# EAGLE design HallSensor (EAGLE 8.7.1)
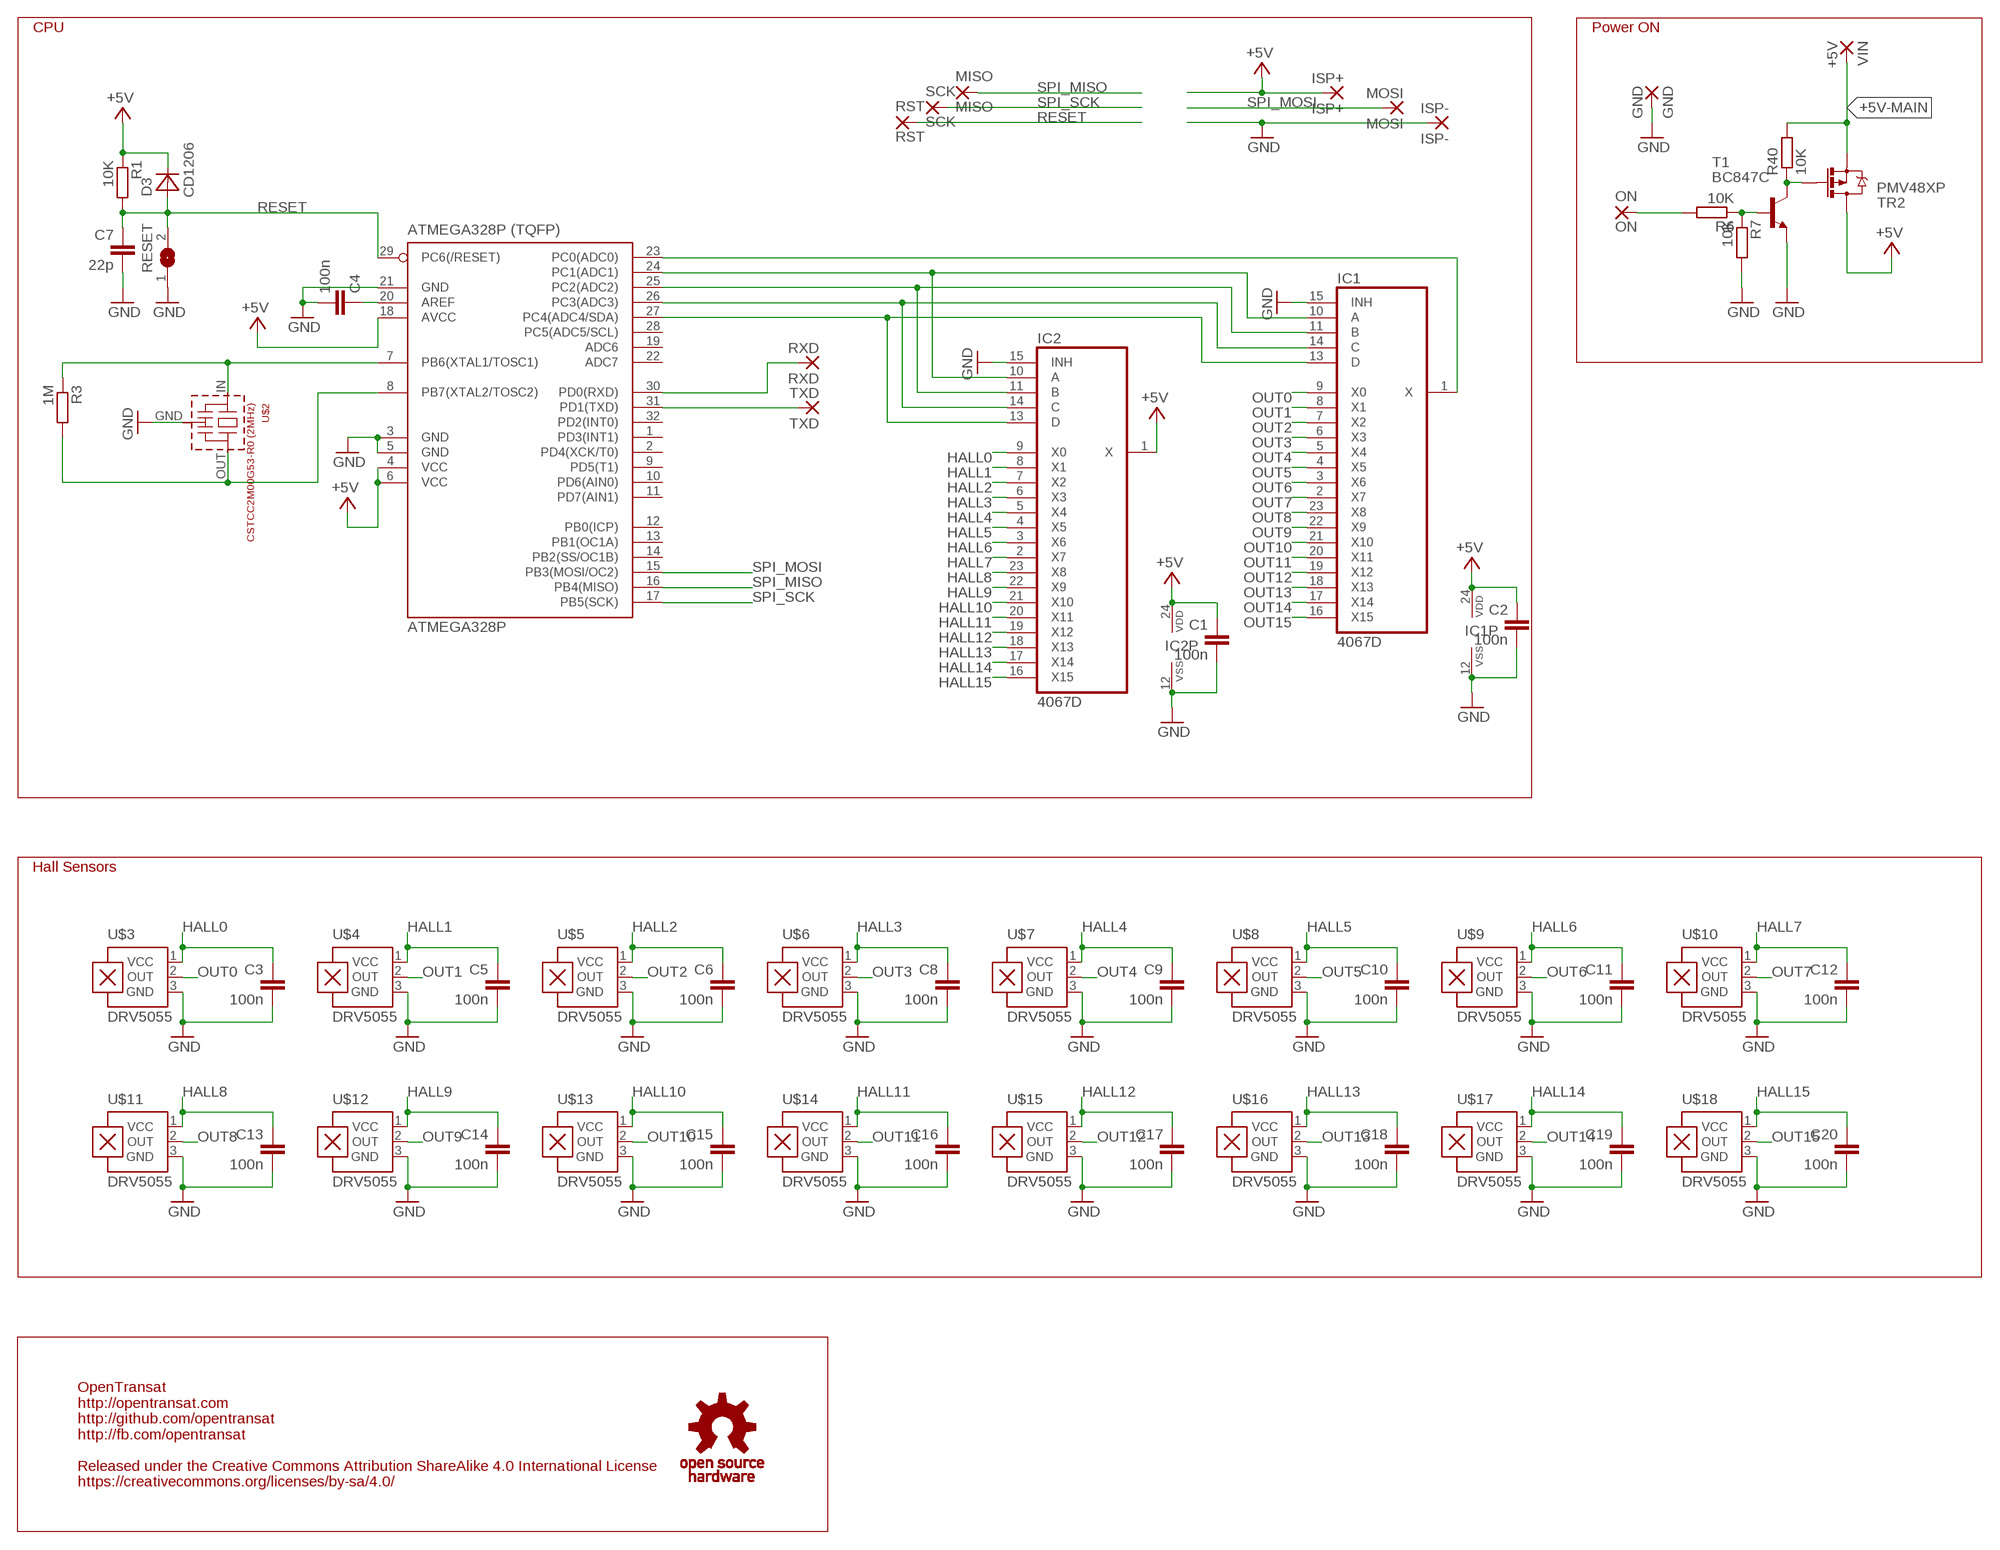
[diagram p0: schematic, sheet 1]

## Parts
ATMEGA328P  ATMEGA328P (TQFP)  MEGA8-AI  [TQFP32-08]
C1  100n  C-EUC0603  [C0603]
C2  100n  C-EUC0603  [C0603]
C3  100n  C-EUC0603  [C0603]
C4  100n  C-EUC0603  [C0603]
C5  100n  C-EUC0603  [C0603]
C6  100n  C-EUC0603  [C0603]
C7  22p  C-EUC0603  [C0603]
C8  100n  C-EUC0603  [C0603]
C9  100n  C-EUC0603  [C0603]
C10  100n  C-EUC0603  [C0603]
C11  100n  C-EUC0603  [C0603]
C12  100n  C-EUC0603  [C0603]
C13  100n  C-EUC0603  [C0603]
C14  100n  C-EUC0603  [C0603]
C15  100n  C-EUC0603  [C0603]
C16  100n  C-EUC0603  [C0603]
C17  100n  C-EUC0603  [C0603]
C18  100n  C-EUC0603  [C0603]
C19  100n  C-EUC0603  [C0603]
C20  100n  C-EUC0603  [C0603]
D3  CD1206  [R1206]
GND  GND  SMD5  [SMD2,54-5,08]
IC1  4067D  [SO24W]
IC2  4067D  [SO24W]
ISP+  ISP+  SMD5  [SMD2,54-5,08]
ISP-  ISP-  SMD5  [SMD2,54-5,08]
MISO  MISO  SMD5  [SMD2,54-5,08]
MOSI  MOSI  SMD5  [SMD2,54-5,08]
ON  ON  SMD5  [SMD2,54-5,08]
R1  10K  R-EU_R0603  [R0603]
R3  1M  R-EU_R0603  [R0603]
R6  10K  R-EU_R0603  [R0603]
R7  10K  R-EU_R0603  [R0603]
R40  10K  R-EU_R0603  [R0603]
RESET  SJW  [SJW]
RST  RST  SMD5  [SMD2,54-5,08]
RXD  RXD  SMD5  [SMD2,54-5,08]
SCK  SCK  SMD5  [SMD2,54-5,08]
T1  BC847C  BC847  [SOT23]
TR2  PMV48XP  MOSFET-PCHANNEL_SOT23-3  [SOT23-3]
TXD  TXD  SMD5  [SMD2,54-5,08]
U$1  OSHW_S  [OSHWS]
U$2  CSTCC2M00G53-R0 (2MHz)  CSTCC  [CSTCC]
U$3  DRV5055  [SOT23]
U$4  DRV5055  [SOT23]
U$5  DRV5055  [SOT23]
U$6  DRV5055  [SOT23]
U$7  DRV5055  [SOT23]
U$8  DRV5055  [SOT23]
U$9  DRV5055  [SOT23]
U$10  DRV5055  [SOT23]
U$11  DRV5055  [SOT23]
U$12  DRV5055  [SOT23]
U$13  DRV5055  [SOT23]
U$14  DRV5055  [SOT23]
U$15  DRV5055  [SOT23]
U$16  DRV5055  [SOT23]
U$17  DRV5055  [SOT23]
U$18  DRV5055  [SOT23]
VIN  +5V  SMD5  [SMD2,54-5,08]

## Nets
+5V: ATMEGA328P.4(VCC) ATMEGA328P.6(VCC) ATMEGA328P.18(AVCC) C1.1 C2.1 D3.2(C) IC1.24(VDD) IC2.1(X) IC2.24(VDD) ISP+.1(P) R1.1 TR2.3(D)
+5V-MAIN: R40.2 TR2.2(S) VIN.1(P)
AREF: ATMEGA328P.20(AREF) C4.1
GND [GND]: ATMEGA328P.3(GND) ATMEGA328P.5(GND) ATMEGA328P.21(GND) C1.2 C2.2 C3.2 C4.2 C5.2 C6.2 C7.2 C8.2 C9.2 C10.2 C11.2 C12.2 C13.2 C14.2 C15.2 C16.2 C17.2 C18.2 C19.2 C20.2 GND.1(P) IC1.12(VSS) IC1.15(INH) IC2.12(VSS) IC2.15(INH) ISP-.1(P) R7.2 RESET.1 T1.2(E) U$2.GND U$3.3(GND) U$4.3(GND) U$5.3(GND) U$6.3(GND) U$7.3(GND) U$8.3(GND) U$9.3(GND) U$10.3(GND) U$11.3(GND) U$12.3(GND) U$13.3(GND) U$14.3(GND) U$15.3(GND) U$16.3(GND) U$17.3(GND) U$18.3(GND)
HALL0: C3.1 IC2.9(X0) U$3.1(VCC)
HALL1: C5.1 IC2.8(X1) U$4.1(VCC)
HALL2: C6.1 IC2.7(X2) U$5.1(VCC)
HALL3: C8.1 IC2.6(X3) U$6.1(VCC)
HALL4: C9.1 IC2.5(X4) U$7.1(VCC)
HALL5: C10.1 IC2.4(X5) U$8.1(VCC)
HALL6: C11.1 IC2.3(X6) U$9.1(VCC)
HALL7: C12.1 IC2.2(X7) U$10.1(VCC)
HALL8: C13.1 IC2.23(X8) U$11.1(VCC)
HALL9: C14.1 IC2.22(X9) U$12.1(VCC)
HALL10: C15.1 IC2.21(X10) U$13.1(VCC)
HALL11: C16.1 IC2.20(X11) U$14.1(VCC)
HALL12: C17.1 IC2.19(X12) U$15.1(VCC)
HALL13: C18.1 IC2.18(X13) U$16.1(VCC)
HALL14: C19.1 IC2.17(X14) U$17.1(VCC)
HALL15: C20.1 IC2.16(X15) U$18.1(VCC)
L13: ATMEGA328P.23(PC0(ADC0)) IC1.1(X)
N$1: R6.1 R7.1 T1.1(B)
N$2: ATMEGA328P.30(PD0(RXD)) RXD.1(P)
N$3: ATMEGA328P.31(PD1(TXD)) TXD.1(P)
N$4: ON.1(P) R6.2
N$5: ATMEGA328P.24(PC1(ADC1)) IC1.10(A) IC2.10(A)
N$6: ATMEGA328P.25(PC2(ADC2)) IC1.11(B) IC2.11(B)
N$7: ATMEGA328P.26(PC3(ADC3)) IC1.14(C) IC2.14(C)
N$8: ATMEGA328P.27(PC4(ADC4/SDA)) IC1.13(D) IC2.13(D)
N$35: R40.1 T1.3(C) TR2.1(G)
OUT0: IC1.9(X0) U$3.2(OUT)
OUT1: IC1.8(X1) U$4.2(OUT)
OUT2: IC1.7(X2) U$5.2(OUT)
OUT3: IC1.6(X3) U$6.2(OUT)
OUT4: IC1.5(X4) U$7.2(OUT)
OUT5: IC1.4(X5) U$8.2(OUT)
OUT6: IC1.3(X6) U$9.2(OUT)
OUT7: IC1.2(X7) U$10.2(OUT)
OUT8: IC1.23(X8) U$11.2(OUT)
OUT9: IC1.22(X9) U$12.2(OUT)
OUT10: IC1.21(X10) U$13.2(OUT)
OUT11: IC1.20(X11) U$14.2(OUT)
OUT12: IC1.19(X12) U$15.2(OUT)
OUT13: IC1.18(X13) U$16.2(OUT)
OUT14: IC1.17(X14) U$17.2(OUT)
OUT15: IC1.16(X15) U$18.2(OUT)
RESET: ATMEGA328P.29(PC6(/RESET)) C7.1 D3.1(A) R1.2 RESET.2 RST.1(P)
SPI_MISO: ATMEGA328P.16(PB4(MISO)) MISO.1(P)
SPI_MOSI: ATMEGA328P.15(PB3(MOSI/OC2)) MOSI.1(P)
SPI_SCK: ATMEGA328P.17(PB5(SCK)) SCK.1(P)
XTAL1: ATMEGA328P.8(PB7(XTAL2/TOSC2)) R3.2 U$2.OUT
XTAL2: ATMEGA328P.7(PB6(XTAL1/TOSC1)) R3.1 U$2.IN
Unconnected: ATMEGA328P.1(PD3(INT1)) ATMEGA328P.2(PD4(XCK/T0)) ATMEGA328P.9(PD5(T1)) ATMEGA328P.10(PD6(AIN0)) ATMEGA328P.11(PD7(AIN1)) ATMEGA328P.12(PB0(ICP)) ATMEGA328P.13(PB1(OC1A)) ATMEGA328P.14(PB2(SS/OC1B)) ATMEGA328P.19(ADC6) ATMEGA328P.22(ADC7) ATMEGA328P.28(PC5(ADC5/SCL)) ATMEGA328P.32(PD2(INT0))

## Notes on the sheet
- CPU | Power ON
- Hall Sensors
- OpenTransat
  http://opentransat.com
  http://github.com/opentransat
  http://fb.com/opentransat
  
  Released under the Creative Commons Attribution ShareAlike 4.0 International License
  https://creativecommons.org/licenses/by-sa/4.0/

## Library data of the parts
ATMEGA328P = atmel:MEGA8: MICROCONTROLLER 8 Kbytes FLASH, 1 kbytes SRAM, 512 bytes EEPROM, USART, 6-channel 10 bit ADC, 2-channel 8 bit ADC Pin compatible with Atmega48, ATMega88, ATMega168 Source: avr.lbr; MPN: ATMEGA8-16AU; OC_FARNELL: 9171371; OC_NEWARK: 73M8863
C1-C20 = rcl:C-EU: CAPACITOR, European symbol; SPICEPREFIX: C
D3 = diodes_smd:CD1206
GND ISP+ ISP- MISO MOSI ON RST RXD SCK TXD VIN = wirepad:SMD5: SMD PAD
IC1 IC2 = 40xx:4067: 16-channel ANALOG MULTIPLEXER
R1 R3 R6 R7 R40 = rcl:R-EU_: RESISTOR, European symbol; SPICEPREFIX: R
RESET = jumper:SJ: SMD solder JUMPER
T1 = transistor:BC847: NPN TRANSISTOR
TR2 = Simplex-DiscreteSemi:MOSFET-PCHANNEL: Generic P-channel mosfet
U$1 = oshw:OSHW_S
U$2 = murata-cstcc-cstcv-resonators:CSTCC: Murata CSTCC Resonator - 7,2 x 3,0 mm
U$3-U$18 = hall:DRV5055

## Net classes
1 power 5V: width 0.305 mm, drill 0.508 mm, clearance 0.203 mm
3 GND: width 0.305 mm, drill 0.508 mm, clearance 0.203 mm
4 3A: width 1.372 mm, drill 1.219 mm, clearance 0.406 mm

## Board
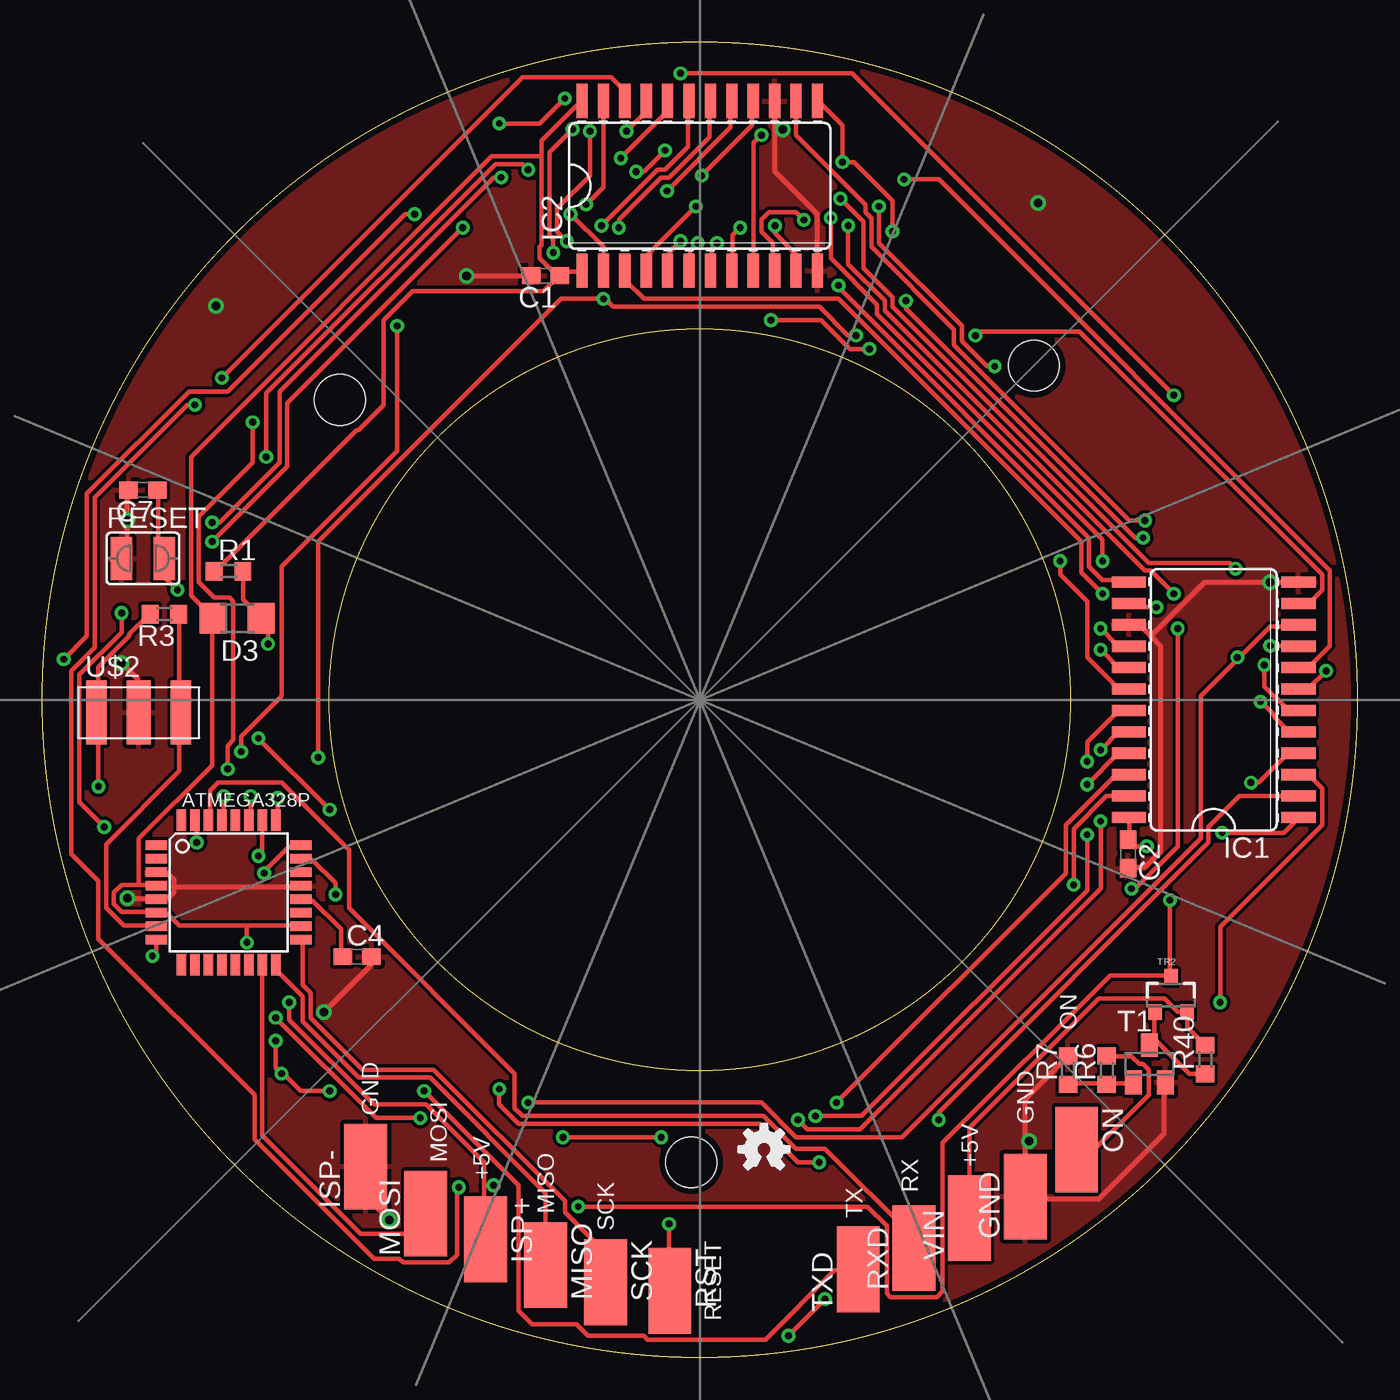
[diagram p1: board, top side]
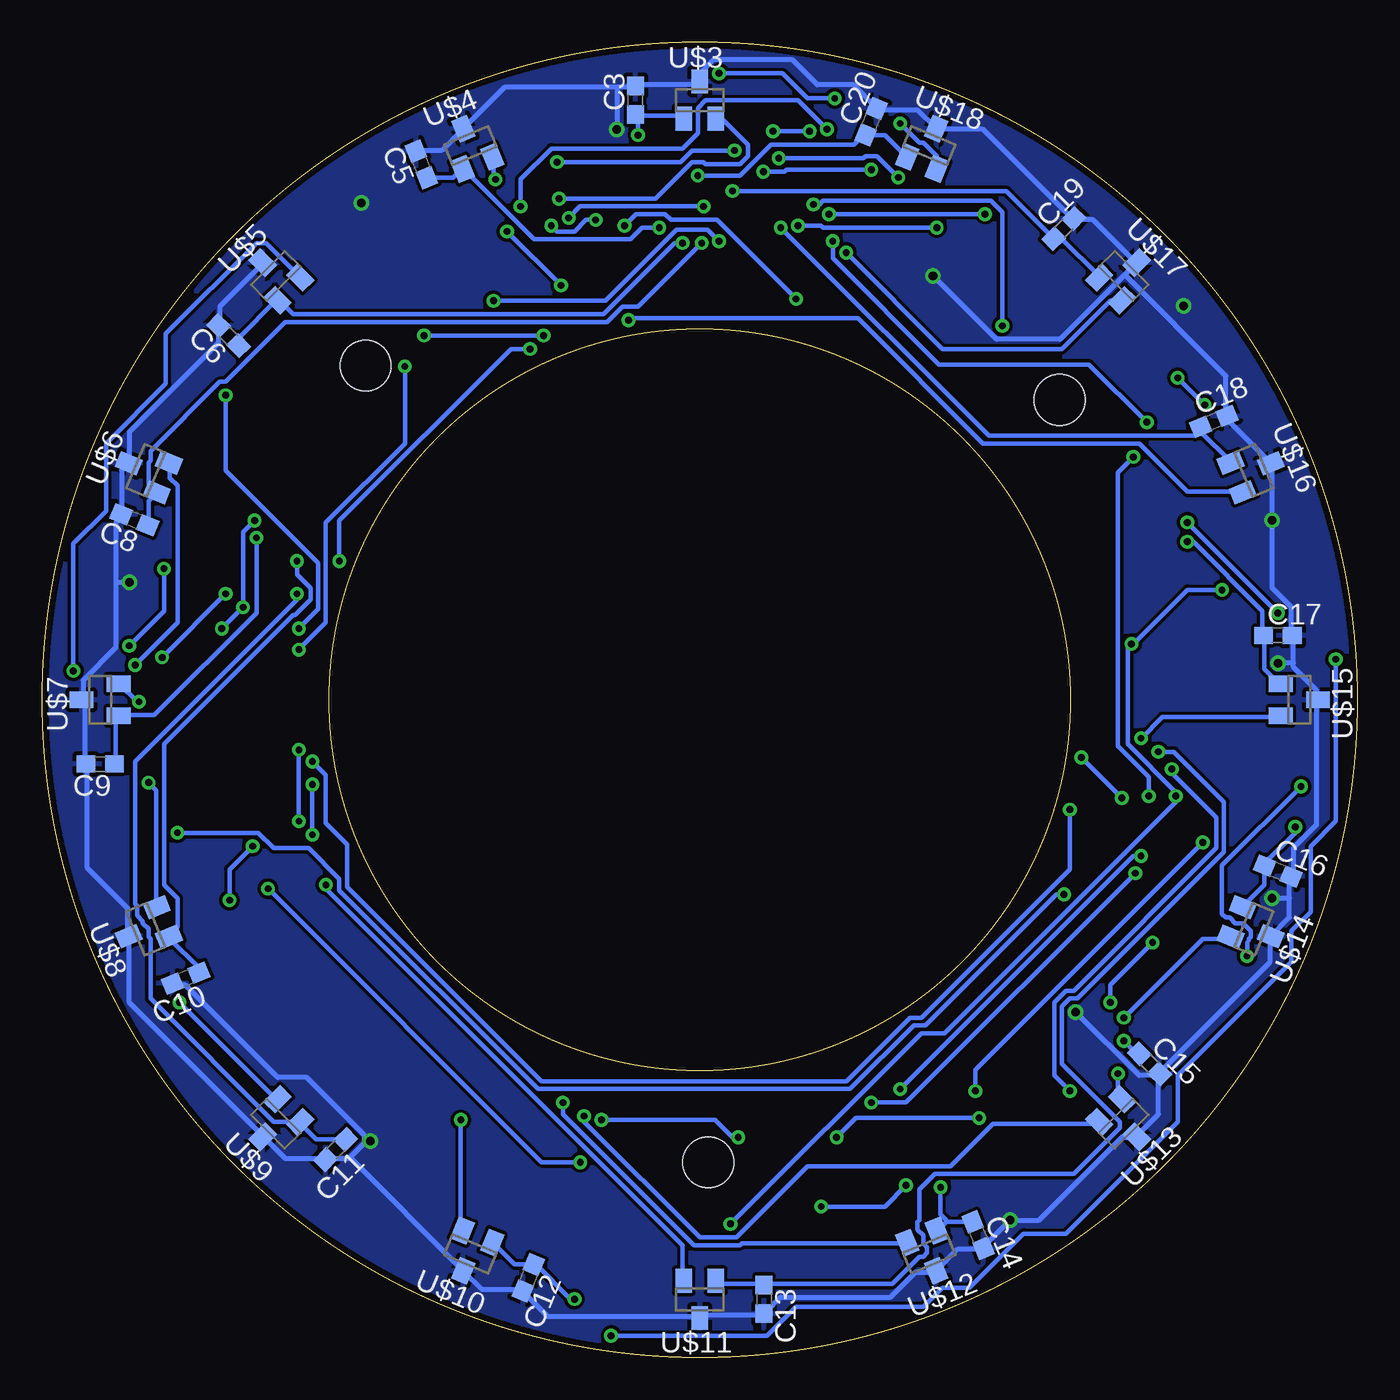
[diagram p2: board, bottom side, seen from below]

Size 78 x 78 mm. Coordinates in mm from the lower left corner, seen from the top.
Outline: circle at 39,39 radius 39
Outline: circle at 39,39 radius 22
Copper layers (1*16): Top 0.035mm / dielectric 1.5mm / Bottom 0.035mm
Design rules "autorouter": minimum track width 10mil, minimum drill 16mil, track to track 8mil, track to pad 8mil, pad to pad 8mil, via to via 8mil, smd to smd 8mil, copper to edge 15mil, drill to drill 12mil, minimum pad ring 10mil, minimum via ring 8mil, stop-mask expansion 1mil, vias tented up to drill 30mil, thermal gap 10mil
Holes 3 mm at 38.49,11.57 17.66,56.78 58.81,58.81

### Footprints (pad centres in the part's own frame; a part is rotated, then mirrored left to right if it is on the bottom)
TQFP32-08 = smd 1.27 x 0.559: 1 -4.293,2.8; 2 -4.293,2; 3 -4.293,1.2; 4 -4.293,0.4; 5 -4.293,-0.4; 6 -4.293,-1.2; 7 -4.293,-2; 8 -4.293,-2.8; 17 4.293,-2.8; 18 4.293,-2; 19 4.293,-1.2; 20 4.293,-0.4; 21 4.293,0.4; 22 4.293,1.2; 23 4.293,2; 24 4.293,2.8 | smd 0.559 x 1.27: 9 -2.8,-4.293; 10 -2,-4.293; 11 -1.2,-4.293; 12 -0.4,-4.293; 13 0.4,-4.293; 14 1.2,-4.293; 15 2,-4.293; 16 2.8,-4.293; 25 2.8,4.293; 26 2,4.293; 27 1.2,4.293; 28 0.4,4.293; 29 -0.4,4.293; 30 -1.2,4.293; 31 -2,4.293; 32 -2.8,4.293
C0603 = smd 1.1 x 1: 1 -0.85,0; 2 0.85,0
R1206 = smd 1.6 x 1.803: 1 -1.422,0; 2 1.422,0
SMD2,54-5,08 = smd 2.54 x 5.08: 1 0,0
SO24W = smd 0.66 x 2.032: 1 -6.985,-5.029; 2 -5.715,-5.029; 3 -4.445,-5.029; 4 -3.175,-5.029; 5 -1.905,-5.029; 6 -0.635,-5.029; 7 0.635,-5.029; 8 1.905,-5.029; 9 3.175,-5.029; 10 4.445,-5.029; 11 5.715,-5.029; 12 6.985,-5.029; 13 6.985,5.029; 14 5.715,5.029; 15 4.445,5.029; 16 3.175,5.029; 17 1.905,5.029; 18 0.635,5.029; 19 -0.635,5.029; 20 -1.905,5.029; 21 -3.175,5.029; 22 -4.445,5.029; 23 -5.715,5.029; 24 -6.985,5.029
R0603 = smd 1 x 1.1: 1 -0.85,0; 2 0.85,0
SJW = smd 1.27 x 2.54: 1 -1.27,0; 2 1.27,0
SOT23 = smd 1 x 1.4: 1 -0.95,-1.1; 2 0.95,-1.1; 3 0,1.1
SOT23-3 = smd 0.8 x 0.9: 1 -0.95,-1; 2 0.95,-1; 3 0,1.1
CSTCC = smd 1.4 x 3.8: GND 0,0 | smd 1.2 x 3.8: IN 2.5,0; OUT -2.5,0

### Placement (x,y rotation side)
ATMEGA328P  11.06,27.57 0 top
C1  29.86,64.15 180 top
C2  64.4,29.86 270 top
C3  42.81,74.56 90 bottom
C4  18.68,23.76 0 top
C5  55.51,70.75 112.5 bottom
C6  66.94,60.59 135 bottom
C7  5.98,51.45 180 top
C8  72.53,49.67 157.5 bottom
C9  74.56,35.19 180 bottom
C10  69.48,22.49 202.5 bottom
C11  60.59,12.33 225 bottom
C12  49.16,4.71 247.5 bottom
C13  35.19,3.44 270 bottom
C14  22.49,7.25 292.5 bottom
C15  12.33,17.41 315 bottom
C16  4.71,28.84 337.5 bottom
C17  4.71,42.81 0 bottom
C18  8.52,55.51 22.5 bottom
C19  17.41,66.94 45 bottom
C20  28.84,73.29 67.5 bottom
D3  11.57,43.83 180 top
GND  58.3,9.54 0 top
IC1  69.48,39 90 top
IC2  39,69.48 0 top
ISP+  26.3,7 180 top
ISP-  19.19,11.31 0 top
MISO  29.86,5.47 180 top
MOSI  22.74,8.52 0 top
ON  61.35,12.33 180 top
R1  11.06,46.62 0 top
R3  7.25,44.08 180 top
R6  63.13,17.03 90 top
R7  60.84,17.03 90 top
R40  68.97,17.66 90 top
RESET  5.98,47.38 0 top
RST  37.22,3.95 180 top
RXD  51.7,6.49 0 top
SCK  33.41,4.46 180 top
T1  65.67,17.41 0 top
TR2  66.94,21.47 0 top
TXD  48.4,5.22 0 top
U$1  42.81,12.33 0 top
U$2  5.73,38.24 0 top
U$3  39,74.56 0 bottom
U$4  52.61,71.85 22.5 bottom
U$5  64.14,64.14 45 bottom
U$6  71.85,52.61 67.5 bottom
U$7  74.56,39 90 bottom
U$8  71.85,25.39 112.5 bottom
U$9  64.14,13.86 135 bottom
U$10  52.61,6.15 157.5 bottom
U$11  39,3.44 180 bottom
U$12  25.39,6.15 202.5 bottom
U$13  13.86,13.86 225 bottom
U$14  6.15,25.39 247.5 bottom
U$15  3.44,39 270 bottom
U$16  6.15,52.61 292.5 bottom
U$17  13.86,64.14 315 bottom
U$18  25.39,71.85 337.5 bottom
VIN  55,8.27 0 top

### Tracks (layer width: path | path; a pad name or v marks a point on that pad's centre or on a via)
+5V  (via drill 0.41)
  Top 0.254: R1.1 10.31,46.66 18.66,55 18.77,55 20.25,56.49 20.25,61.52 21.97,63.23 29.74,63.23 30.66,64.15 C1.1 | IC2.1 31.91,64.38 30.88,64.38 30.77,64.26 C1.1 | 29.63,71.23 29.63,65.97 29.51,65.86 29.51,65.17 30.54,64.15 C1.1 | 29.63,71.23 29.63,72.15 31.91,74.43 IC2.24 | v66.89,27.11 66.89,22.66 TR2.3 66.78,22.66 63.35,22.66 53.4,12.71 53.4,3.91 53.06,3.57 50.32,3.57 50.09,3.8 50.09,7.8 48.94,8.94 v31.8,8.94 | v65.52,30.31 64.83,30.31 64.49,30.66 C2.1 64.49,30.77 64.49,31.91 IC1.24 | 5.74,28.03 6.77,28.03 ATMEGA328P.4 | 5.74,28.03 4.71,28.03 4.25,27.57 4.25,26.88 4.71,26.43 6.77,26.43 ATMEGA328P.6 6.88,26.31 7.45,26.31 8.14,25.63 12.14,25.63 | 12.14,25.63 15.34,25.63 ATMEGA328P.18 | 5.74,28.03 5.74,30.77 10.08,35.11 10.08,43.8 D3.2 10.08,43.91 8.82,45.17 8.82,53.4 26.66,71.23 29.63,71.23 | 26.2,10.2 26.2,11.57 22.77,15 19.68,15 14.65,20.03 v14.65,21.05 | 26.2,10.2 26.2,7 ISP+.1 | 12.14,25.63 v12.14,24.6 | 26.2,10.2 v26.77,10.2
  Bottom 0.254: v66.89,27.11 66.89,28.94 v65.52,30.31 | v14.65,21.05 14.65,22.08 v12.14,24.6 | v31.8,8.94 28.03,8.94 v26.77,10.2
+5V-MAIN
  Top 0.254: R40.2 68.95,18.54 67.92,19.57 67.92,20.37 TR2.2 67.8,20.48 67.35,20.48 66.55,21.28 62.66,21.28 55,13.62 VIN.1
AREF
  Top 0.254: C4.1 17.74,23.8 17.74,25.4 16.03,27.11 15.45,27.11 ATMEGA328P.20
GND  (via drill 0.51)
  Top 0.305: 43.46,72.83 43.46,70.32 45.97,67.8 45.97,64.49 IC2.12 | 43.46,72.83 43.46,74.43 IC2.15 | v43.91,72.83 43.46,72.83 | v25.17,64.15 C1.2 | 7.8,27.91 7.8,28.37 7.45,28.71 6.77,28.71 ATMEGA328P.3 | 7.8,27.91 7.8,27.57 7.45,27.23 6.77,27.23 ATMEGA328P.5 6.65,27.23 v5.05,27.23 | 7.8,27.91 15.34,27.91 ATMEGA328P.21 | C7.2 5.05,51.34 v5.05,49.63 5.05,47.8 4.71,47.46 RESET.1 | v4.71,41.17 5.62,40.26 5.62,38.31 U$2.GND | 65.75,42.77 65.17,43.34 64.49,43.34 IC1.15 | 65.75,42.77 66.32,42.2 66.32,29.97 65.4,29.06 64.49,29.06 C2.2 | 65.75,42.77 68.95,45.97 v72.83,45.97 74.43,45.97 IC1.12 | 58.32,12.82 58.32,9.62 GND.1 58.32,9.4 62.66,9.4 66.55,13.28 66.55,16.25 T1.2 | 58.32,12.82 58.32,15.34 60.83,17.86 R7.2 | v16.71,20.48 19.45,23.23 19.45,23.68 C4.2 | v20.6,8.14 19.23,9.51 19.23,11.23 ISP-.1 | v58.55,12.82 58.32,12.82
  Bottom 0.305: C5.2 55.8,71.58 54.32,71.58 53.06,72.83 U$4.3 52.95,72.95 50.54,75.35 43.91,75.35 | 43.91,75.35 42.89,75.35 C3.2 42.77,75.46 39.11,75.46 39,75.58 U$3.3 39,76.15 38.2,76.95 33.51,76.95 32.03,75.46 29.86,75.46 28.6,74.2 C20.2 28.48,73.98 26.08,73.98 25.05,72.95 U$18.3 24.83,72.83 22.2,72.83 16.94,67.58 C19.2 16.71,67.46 15.68,67.46 13.17,64.95 U$17.3 13.17,64.83 13.8,64.2 | 43.91,75.35 v43.91,72.83 | v25.17,64.15 21.4,60.37 17.63,60.37 13.8,64.2 | 4.02,27.23 4.02,26.08 5.05,25.05 U$14.3 5.17,24.83 5.17,23.45 11.68,16.94 C15.2 | 4.02,27.23 4.02,28.48 C16.2 3.8,28.6 3.8,30.2 2.42,31.57 2.42,38.89 U$15.3 2.42,39 2.42,39.57 3.8,40.94 3.8,41.17 | 3.8,41.17 3.8,42.77 C17.2 3.91,42.89 3.91,44.49 5.05,45.63 v5.05,49.63 5.05,52.95 U$16.3 5.17,53.06 7.68,55.57 7.68,55.8 C18.2 7.8,55.92 7.8,58.2 13.8,64.2 | 3.8,41.17 v4.71,41.17 | 4.02,27.23 v5.05,27.23 | U$5.3 64.95,64.83 67.46,62.32 67.46,61.29 C6.2 67.58,61.06 67.58,60.14 72.83,54.89 72.83,53.17 U$6.3 72.95,52.95 73.29,52.6 73.29,50.09 C8.2 73.29,49.86 73.63,49.52 73.63,45.97 | 73.63,45.97 73.63,42.09 75.58,40.14 75.58,39.11 U$7.3 75.58,39 75.46,38.89 75.46,35.23 C9.2 75.35,35.11 75.35,29.06 72.95,26.66 72.95,25.05 U$8.3 72.83,24.83 72.83,21.05 64.95,13.17 U$9.3 64.83,13.05 63.58,11.8 61.29,11.8 C11.2 61.06,11.8 59.8,11.8 59.75,11.85 | 73.63,45.97 v72.83,45.97 | 58.89,12.82 58.89,12.71 59.75,11.85 | 58.89,12.82 58.89,13.17 62.32,16.6 64.03,16.6 69.52,22.08 70.2,22.08 C10.2 | C15.2 11.8,16.71 11.8,14.43 13.05,13.17 U$13.3 13.17,13.05 13.97,13.05 18.88,8.14 v20.6,8.14 22.2,6.54 C14.2 22.2,6.42 23.68,6.42 24.94,5.17 U$12.3 25.05,5.05 26.2,5.05 27.68,3.57 34.2,3.57 35.11,2.65 C13.2 35.23,2.54 38.89,2.54 39,2.42 U$11.3 39.11,2.42 48.03,2.42 49.4,3.8 C12.2 49.52,4.02 51.92,4.02 52.95,5.05 U$10.3 53.06,5.17 59.75,11.85
  Bottom 0.305: v16.71,20.48 12.94,16.71 11.91,16.71 C15.2 | 58.89,12.82 v58.55,12.82
  other vias: 59.07,68.46 10.3,62.37
  pour Bottom: -9.26,-7.99 -9.26,84.72 93.61,84.72 93.61,-7.99
  pour Top: -10.53,87.26 -10.53,-10.53 96.15,-10.53 96.15,87.26
HALL0  (via drill 0.41)
  Top 0.254: v42.66,72.49 42.2,72.03 42.2,64.49 IC2.9
  Bottom 0.254: U$3.1 40.03,73.52 40.14,73.63 42.77,73.63 C3.1 42.66,73.52 v42.66,72.49
HALL1  (via drill 0.41)
  Top 0.254: v41.4,67 40.94,66.55 40.94,64.49 IC2.8
  Bottom 0.254: C5.1 55.12,69.97 53.63,69.97 53.17,70.43 U$4.1 52.95,70.43 48.83,66.32 43.12,66.32 42.43,67 v41.4,67
HALL2  (via drill 0.41)
  Top 0.254: v40.03,66.09 39.69,65.75 39.69,64.49 IC2.7
  Bottom 0.254: C6.1 66.32,60.03 66.32,60.49 64.15,62.66 U$5.1 63.92,62.66 63.12,61.86 44.72,61.86 40.49,66.09 v40.03,66.09
HALL3  (via drill 0.41)
  Top 0.254: v38.89,66.09 38.43,65.63 38.43,64.49 IC2.6
  Bottom 0.254: C8.1 71.69,49.4 71.69,50.77 71.23,51.23 U$6.1 71.23,51.34 71.69,51.8 71.69,53.06 71.58,53.17 71.58,53.74 67.46,57.86 67.12,57.86 63.58,61.4 44.49,61.4 43.57,62.32 42.66,62.32 v38.89,66.09
HALL4  (via drill 0.41)
  Top 0.254: v37.86,66.2 37.17,65.52 37.17,64.49 IC2.5 | v51.23,62.66 51.23,62.2 64.83,48.6 v65.29,48.6
  Bottom 0.254: C9.1 73.63,35.23 73.63,37.86 73.52,37.97 U$7.1 73.4,38.09 71.35,38.09 65.29,44.14 v65.29,48.6 | v37.86,66.2 38.54,66.89 40.37,66.89 44.6,62.66 v51.23,62.66
HALL5  (via drill 0.41)
  Top 0.254: v38.77,68.26 35.91,65.4 35.91,64.49 IC2.4 | v46.77,67.58 46.77,65.17 49.52,62.43 49.52,61.86 62.89,48.49 v62.89,47.23
  Bottom 0.254: C10.1 68.72,22.88 68.72,23.11 70.43,24.83 U$8.1 70.43,25.05 69.97,25.51 69.97,27.23 70.78,28.03 70.78,36.37 63.12,44.03 63,44.03 62.09,44.94 62.09,45.63 62.89,46.43 v62.89,47.23 | v38.77,68.26 46.09,68.26 v46.77,67.58
HALL6  (via drill 0.41)
  Top 0.254: v62.89,45.29 61.63,46.54 61.63,48.37 47.23,62.77 35.69,62.77 34.66,63.8 34.66,64.38 IC2.3
  Bottom 0.254: C11.1 60.03,12.94 61.75,12.94 62.66,13.85 U$9.1 62.77,13.97 64.26,13.97 71.58,21.28 71.58,24.83 71.69,24.94 71.69,25.4 72.03,25.74 72.03,25.86 72.38,26.2 72.38,26.77 72.49,26.88 72.49,35.34 62.89,44.94 v62.89,45.29
HALL7  (via drill 0.41)
  Top 0.254: IC2.2 33.28,65.86 v31.34,67.8 | v22.08,67.8 21.51,67.8 11,57.29 8.71,57.29 2.65,51.23 2.65,42.77 v1.28,41.4 | v46.43,3.45 v44.26,1.28
  Bottom 0.254: U$10.1 51.23,6.77 49.97,5.51 48.94,5.51 C12.1 48.72,5.51 46.66,3.45 v46.43,3.45 | v22.08,67.8 v31.34,67.8 | v1.28,41.4 1.28,31.8 2.77,30.31 2.77,26.43 3.91,25.28 3.91,23.45 10.65,16.71 10.65,13.97 17.28,7.34 19.8,7.34 23,4.14 24.6,4.14 25.74,2.99 33.28,2.99 35,1.28 v44.26,1.28
HALL8  (via drill 0.41)
  Top 0.254: IC2.23 33.28,69.4 v32.26,68.38 | v21.05,61.17 21.05,53.74 14.2,46.89 14.2,39.23 11.8,36.83 v11.8,35.91
  Bottom 0.254: U$11.1 37.97,4.48 37.86,4.37 35.23,4.37 C13.1 35.11,4.37 27.57,4.37 25.97,5.97 25.74,5.97 25.51,6.2 25.51,6.54 25.74,6.77 25.74,7.23 26.08,7.57 26.08,8.02 25.97,8.14 25.97,9.97 25.05,10.88 16.83,10.88 14.08,13.62 14.08,13.97 17.51,17.4 17.51,20.83 17.05,21.28 16.6,21.28 7.91,29.97 7.91,32.94 10.88,35.91 v11.8,35.91 | v32.26,68.38 31.91,68.38 31.68,68.6 21.74,68.6 21.05,67.92 v21.05,61.17
HALL9  (via drill 0.41)
  Top 0.254: v10.65,58.09 28.48,75.92 33.74,75.92 34.54,75.12 34.54,74.55 IC2.22 | v9.05,56.49 8.6,56.49 3.11,51 3.11,42.09 1.74,40.71 1.74,29.86 3.34,28.26 3.34,24.83 12.6,15.57 12.6,12.94 19.68,5.85 21.17,5.85 21.4,5.62 24.14,5.62 24.6,6.08 24.6,9.97 v24.71,10.08
  Bottom 0.254: 24.37,8.02 22.88,8.02 C14.1 | 24.37,8.02 24.83,7.57 U$12.1 | v9.05,56.49 v10.65,58.09 | v24.71,10.08 24.71,8.48 24.37,8.14 24.37,8.02
HALL10  (via drill 0.41)
  Top 0.254: v13.85,18.77 13.85,17.17 v14.2,16.83 14.31,16.83 15.34,15.8 v17.05,15.8 | v34.66,72.72 35.8,73.86 35.8,74.43 IC2.21 | v32.48,72.72 32.48,70.09 30.54,68.15 30.54,66.78 v31.11,66.2 | v12.48,55.46 12.48,53.06 9.28,49.86 9.28,45.97 10.2,45.06 11.11,45.06 11.34,44.83 11.34,36.6 11,36.26 v11,34.88
  Bottom 0.254: v13.85,18.77 13.17,18.08 12.94,18.08 C15.1 | v14.2,16.83 14.2,15.57 13.97,15.34 U$13.1 | v32.48,72.72 v34.66,72.72 | v31.11,66.2 31.11,65.17 24.83,58.89 15.91,58.89 v12.48,55.46 | v11,34.88 11,34.66 8.37,32.03 8.37,30.2 16.83,21.74 17.28,21.74 17.97,21.05 17.97,16.71 v17.05,15.8
HALL11  (via drill 0.41)
  Top 0.254: v34.31,71.12 37.06,73.86 37.06,74.43 IC2.20 | v27.23,69.97 26.77,69.97 14.08,57.29 14.08,53.06 10.54,49.52 v10.08,49.52 | v4.71,44.14 4.71,43 2.2,40.49 2.2,32.94 v3.68,31.46
  Bottom 0.254: U$14.1 6.77,26.77 5.51,28.03 5.51,29.06 C16.1 5.51,29.28 3.68,31.11 v3.68,31.46 | v34.31,71.12 29.28,71.12 29.17,71.23 28.48,71.23 v27.23,69.97 | v4.71,44.14 v10.08,49.52
HALL12  (via drill 0.41)
  Top 0.254: v33.17,67.12 36.48,70.43 36.94,70.43 38.31,71.8 38.31,74.43 IC2.19 | v24.94,67 14.54,56.6 14.54,52.83 v10.08,48.37
  Bottom 0.254: U$15.1 4.6,39.91 5.51,40.83 5.51,42.77 C17.1 5.62,42.89 5.62,44.26 9.74,48.37 v10.08,48.37 | v33.17,67.12 31.8,67.12 31.68,67 v24.94,67
HALL13  (via drill 0.41)
  Top 0.254: v34.2,67 34.2,67.46 36.71,69.97 37.17,69.97 39.57,72.38 39.57,74.43 IC2.18
  Bottom 0.254: U$16.1 7.57,53.17 9.28,54.89 9.28,55.12 C18.1 9.4,54.89 9.62,54.66 21.86,54.66 v34.2,67
HALL14  (via drill 0.41)
  Top 0.254: v37.06,69.17 40.83,72.95 40.83,74.43 IC2.17
  Bottom 0.254: U$17.1 15.34,64.15 17.51,66.32 17.97,66.32 C19.1 18.08,66.43 20.83,69.17 v37.06,69.17
HALL15  (via drill 0.41)
  Top 0.254: v39.11,70.09 42.09,73.06 42.09,74.43 IC2.16
  Bottom 0.254: U$18.1 26.77,71.23 28.03,72.49 29.06,72.49 C20.1 29.28,72.49 29.86,71.92 34.77,71.92 36.6,70.09 v39.11,70.09
L13  (via drill 0.41)
  Top 0.254: v17.4,27.46 17.4,28.14 16.03,29.51 15.45,29.51 ATMEGA328P.23 | v69.97,31.11 73.63,31.11 74.43,31.91 IC1.1
  Bottom 0.254: v17.4,27.46 17.86,27.46 25.63,19.68 26.31,19.68 30.09,15.91 48.6,15.91 60.37,27.68 60.37,28.37 62.2,30.2 64.26,30.2 65.17,31.11 v69.97,31.11
N$1
  Top 0.254: R7.1 60.95,16.25 63.12,16.25 R6.1 63.23,16.25 64.72,16.25 T1.1
N$2
  Top 0.254: ATMEGA328P.30 9.97,31.91 9.97,33.63 10.43,34.09 14.2,34.09 18.2,30.09 18.2,26.66 28.03,16.83 28.03,14.77 28.48,14.31 42.77,14.31 44.72,12.37 46.43,12.37 51.69,7.11 51.69,6.54 RXD.1
N$3  (via drill 0.41)
  Top 0.254: v9.17,30.54 9.17,31.8 ATMEGA328P.31 | v22.66,15.8 28.26,10.2 28.26,2.77 29.06,1.97 31.68,1.97 32.37,1.28 35.69,1.28 35.91,1.05 42.89,1.05 47,5.17 48.37,5.17 TXD.1
  Bottom 0.254: v9.17,30.54 22.66,17.05 v22.66,15.8
N$4
  Top 0.254: R6.2 63.23,17.86 64.6,17.86 65.06,17.4 65.29,17.4 65.63,17.05 65.63,15.57 62.43,12.37 61.4,12.37 ON.1
N$5  (via drill 0.41)
  Top 0.254: v13.17,28.71 13.17,28.83 14.65,30.31 15.34,30.31 ATMEGA328P.24 | v28.83,15.11 42.66,15.11 44.72,13.05 51,13.05 68.72,30.77 68.72,39.23 70.95,41.46 | 70.95,41.46 72.83,43.34 74.43,43.34 IC1.10 | v45.17,67.46 44.72,67.92 43.12,67.92 42.66,67.46 42.66,66.78 43.34,66.09 43.34,64.49 IC2.10 | v47.8,67.12 47.8,64.83 49.97,62.66 49.97,62.09 65.4,46.66 65.75,46.66 v67.12,45.29 | v70.89,41.52 70.95,41.46
  Bottom 0.254: v13.17,28.71 26.77,15.11 v28.83,15.11 | v45.17,67.46 45.74,67.46 46.43,66.78 47.46,66.78 v47.8,67.12 | v70.89,41.52 v67.12,45.29
N$6  (via drill 0.41)
  Top 0.254: v13.97,33.17 13.97,31.91 ATMEGA328P.25 | v16.37,35.57 16.37,48.37 30.77,62.77 v33.28,62.77 33.4,62.77 33.86,62.32 46.09,62.32 47.8,60.6 v48.26,60.6 | v43.46,67.12 43.46,66.66 44.72,65.4 IC2.11 | IC1.11 75.12,44.72 75.92,45.52 75.92,46.43 61.52,60.83 55.57,60.83 v55.34,60.6
  Bottom 0.254: v16.37,35.57 v13.97,33.17 | v33.28,62.77 37.97,67.46 40.71,67.46 41.06,67.8 42.77,67.8 v43.46,67.12 | v48.26,60.6 v55.34,60.6
N$7  (via drill 0.41)
  Top 0.254: v12.82,29.74 13.05,29.97 13.05,31.8 ATMEGA328P.26 | v27.11,15.91 27.11,15 28.26,13.85 42.54,13.85 44.83,11.57 v46.09,11.57 | v64.6,27.8 64.83,27.8 67.35,30.31 v67.35,43.23 | v66.09,44.49 64.72,44.49 64.49,44.72 IC1.14 | IC2.14 44.72,72.49 48.83,68.38 48.83,67.92 49.17,67.58 49.17,65.86 54.09,60.95 54.09,60.03 64.49,49.63 v65.4,49.63
  Bottom 0.254: v12.82,29.74 13.28,29.74 v27.11,15.91 | v46.09,11.57 48.37,11.57 v64.6,27.8 | v67.35,43.23 v66.09,44.49 66.09,48.94 v65.4,49.63
N$8  (via drill 0.41)
  Top 0.254: v12.37,33.28 12.37,31.91 ATMEGA328P.27 | v13.28,53.4 13.28,57.17 26.88,70.78 28.48,70.78 v28.83,70.43 | v35.23,70.32 35.69,70.32 v36.94,71.58 | IC2.13 46.09,74.43 47.46,73.06 v47.46,70.89 48.14,70.89 50.43,68.6 v50.43,66.78 | v47.23,63.58 47.23,63.46 62.09,48.6 62.09,46.89 62.89,46.09 64.38,46.09 IC1.13
  Bottom 0.254: v12.37,33.28 12.37,34.43 14.2,36.26 14.2,52.49 v13.28,53.4 | v28.83,70.43 33.86,70.43 33.97,70.32 v35.23,70.32 | v36.94,71.58 39.46,71.58 40.14,70.89 v47.46,70.89 | v50.43,66.78 v47.23,63.58
N$35
  Top 0.254: TR2.1 65.97,20.37 65.97,18.77 65.75,18.54 T1.3 66.09,18.77 68.03,16.83 68.95,16.83 R40.1
OUT0  (via drill 0.41)
  Top 0.254: v47.34,68.72 48.72,67.35 48.72,64.6 50.43,62.89 50.43,62.32 65.63,47.12 70.43,47.12 v70.78,46.77 | v72.83,42.2 74.43,42.2 IC1.9
  Bottom 0.254: v47.34,68.72 41.63,68.72 39.46,70.89 38.77,70.89 38.66,70.78 36.6,70.78 36.14,71.23 36.14,71.92 37.63,73.4 37.97,73.4 U$3.2 | v70.78,46.77 70.78,44.26 v72.83,42.2
OUT1  (via drill 0.41)
  Top 0.254: v51.12,69.86 53.17,69.86 76.38,46.66 76.38,42.2 75.12,40.94 74.55,40.94 IC1.8
  Bottom 0.254: v51.12,69.86 51.23,69.97 51.23,71.12 U$4.2
OUT2  (via drill 0.41)
  Top 0.254: v76.15,40.71 75.12,39.69 74.55,39.69 IC1.7
  Bottom 0.254: v76.15,40.71 76.15,48.26 74.2,50.2 74.2,54.2 70.66,57.75 70.66,60.72 65.29,66.09 64.72,66.09 62.77,64.15 U$5.2
OUT3  (via drill 0.41)
  Top 0.254: v72.49,41.06 72.49,39.8 73.86,38.43 74.43,38.43 IC1.6
  Bottom 0.254: v72.49,41.06 69.97,43.57 69.97,51.69 70.43,52.14 70.43,53.06 U$6.2
OUT4  (via drill 0.41)
  Top 0.254: v72.26,38.89 73.06,38.09 73.06,37.97 73.86,37.17 74.43,37.17 IC1.5
  Bottom 0.254: v72.26,38.89 72.38,38.89 73.4,39.91 U$7.2
OUT5  (via drill 0.41)
  Top 0.254: v71.69,34.09 72.15,34.09 73.86,35.8 74.43,35.8 IC1.4
  Bottom 0.254: v71.69,34.09 71.23,33.63 71.23,26.77 U$8.2
OUT6  (via drill 0.41)
  Top 0.254: v69.86,21.05 69.86,25.51 75.92,31.57 75.92,33.74 75.12,34.54 74.55,34.54 IC1.3
  Bottom 0.254: v69.86,21.05 64.15,15.34 U$9.2
OUT7  (via drill 0.41)
  Top 0.254: v53.17,14.08 53.17,14.54 69.17,30.54 69.17,31.46 71,33.28 IC1.2
  Bottom 0.254: v53.17,14.08 53.17,7.57 U$10.2
OUT8  (via drill 0.41)
  Top 0.254: v61.17,28.03 61.17,31.34 63.12,33.28 IC1.23
  Bottom 0.254: v61.17,28.03 61.17,27.8 40.03,6.65 40.03,4.6 U$11.2
OUT9  (via drill 0.41)
  Top 0.254: v47.12,15.11 60.72,28.71 60.72,31.57 63.69,34.54 64.38,34.54 IC1.22
  Bottom 0.254: v47.12,15.11 47.12,14.43 39.34,6.65 36.6,6.65 36.48,6.77 26.77,6.77 U$12.2
OUT10  (via drill 0.41)
  Top 0.254: v45.86,14.31 48.6,14.31 61.97,27.68 v61.97,31 | v61.97,33.97 63.8,35.8 64.38,35.8 IC1.21
  Bottom 0.254: v45.86,14.31 45.86,13.97 39,7.11 36.83,7.11 32.6,11.34 24.14,11.34 21.63,13.85 15.34,13.85 U$13.2 | v61.97,33.97 v61.97,31
OUT11  (via drill 0.41)
  Top 0.254: v13.85,20.14 19.8,14.2 v22.43,14.2 | v36.71,13.05 v30.88,13.05 | v44.83,14.08 45.4,13.51 48.49,13.51 62.77,27.8 v62.77,31.8 | v62.77,36.03 63.8,37.06 64.38,37.06 IC1.20
  Bottom 0.254: v13.85,20.14 9.17,24.83 7.57,24.83 U$14.2 | v22.43,14.2 29.74,14.2 v30.88,13.05 | v36.71,13.05 37.06,13.05 38.09,14.08 v44.83,14.08 | v62.77,36.03 v62.77,31.8
OUT12  (via drill 0.41)
  Top 0.254: v17.05,32.48 v12.82,36.71 | v61.97,35.34 61.97,36.48 63.8,38.31 64.38,38.31 IC1.19
  Bottom 0.254: v12.82,36.71 11.57,37.97 4.6,37.97 U$15.2 | v17.05,32.48 17.05,28.94 25.86,20.14 26.54,20.14 30.31,16.37 48.37,16.37 59.92,27.91 59.92,30.43 61.17,31.68 61.17,34.54 v61.97,35.34
OUT13  (via drill 0.41)
  Top 0.254: v43.23,61.52 46.2,61.52 47.91,59.8 v49.06,59.8 | v60.37,47.23 60.37,46.43 61.97,44.83 61.97,41.52 63.8,39.69 64.38,39.69 IC1.18
  Bottom 0.254: v43.23,61.52 43.12,61.63 29.63,61.63 22.2,54.2 12.94,54.2 10.08,51.34 6.88,51.34 U$16.2 | v49.06,59.8 50.2,59.8 60.37,49.63 v60.37,47.23
OUT14  (via drill 0.41)
  Top 0.254: v30.31,65.52 30.31,66.32 30.09,66.55 30.09,71.46 v31.46,72.83 | v49.63,68.26 49.63,66.09 54.55,61.17 54.55,60.26 56.03,58.77 v56.49,58.77 | v62.77,41.97 63.8,40.94 64.38,40.94 IC1.17
  Bottom 0.254: v30.31,65.52 24.6,59.8 17.51,59.8 14.65,62.66 13.97,62.66 U$17.2 | v31.46,72.83 33.17,74.55 38.66,74.55 39.11,74.09 39.11,72.6 40.03,71.69 47.8,71.69 49.63,69.86 v49.63,68.26 | v56.49,58.77 56.49,54.2 61.17,49.52 61.17,43.57 v62.77,41.97
OUT15  (via drill 0.41)
  Top 0.254: v27.11,73.18 29.51,73.18 v31,74.66 | v37.86,76.15 48.03,76.15 v67.12,57.06 | v62.77,43.23 63.8,42.2 64.38,42.2 IC1.16
  Bottom 0.254: v27.11,73.18 25.97,72.03 25.74,72.03 24.94,71.23 24.94,70.55 U$18.2 | v31,74.66 32.6,74.66 34.09,76.15 v37.86,76.15 | v67.12,57.06 67.12,52.6 61.63,47.12 61.63,44.37 v62.77,43.23
RESET  (via drill 0.41)
  Top 0.254: C7.1 6.88,51.34 6.88,47.8 7.23,47.46 RESET.2 7.34,47.34 7.34,46.2 v8.02,45.52 | R1.2 11.91,46.54 11.91,44.94 12.94,43.91 D3.1 13.05,43.8 13.4,43.46 v13.4,42.31 | v10.77,33.28 10.77,31.91 ATMEGA328P.29 | v37.17,7.91 37.17,4.02 RST.1
  Bottom 0.254: v8.02,45.52 10.08,45.52 13.28,42.31 v13.4,42.31 13.62,42.09 13.62,36.37 10.77,33.51 v10.77,33.28 10.77,32.94 24.48,19.23 25.86,19.23 v37.17,7.91
SPI_MISO
  Top 0.254: MISO.1 29.86,9.74 23,16.6 18.77,16.6 15.45,19.91 15.45,21.4 13.97,22.88 13.97,23.23 ATMEGA328P.16
SPI_MOSI
  Top 0.254: ATMEGA328P.15 13.05,23.23 13.05,13.17 18.88,7.34 21.51,7.34 22.66,8.48 MOSI.1
SPI_SCK
  Top 0.254: ATMEGA328P.17 15.45,24.71 15.45,22.08 15.91,21.63 15.91,20.14 19,17.05 23.23,17.05 31,9.28 31,8.6 33.4,6.2 33.4,4.48 SCK.1
XTAL1  (via drill 0.41)
  Top 0.254: R3.2 6.31,44.03 5.17,42.89 5.17,42.77 3.34,40.94 3.34,38.31 U$2.OUT 3.34,38.2 v3.34,33.86 | ATMEGA328P.8 6.77,24.03 v6.54,23.8
  Bottom 0.254: v6.54,23.8 6.54,24.6 6.42,24.71 6.42,24.83 6.31,24.94 6.31,25.28 6.77,25.74 7.23,25.74 7.57,26.08 7.8,26.08 8.02,26.31 8.02,29.17 v3.34,33.86
XTAL2
  Top 0.254: R3.1 8.14,44.03 8.14,38.31 U$2.IN 8.14,38.2 8.14,34.77 3.8,30.43 3.8,26.66 4.82,25.63 6.77,25.63 ATMEGA328P.7

### Text on the board
_tsilk: ON | GND | GND | MOSI | +5V | +5V | RX | MISO | SCK | TX | RESET